# EAGLE design eu-gate (EAGLE 6.1)
AUTHOR: Vlastimil Slintak; REV: RevA
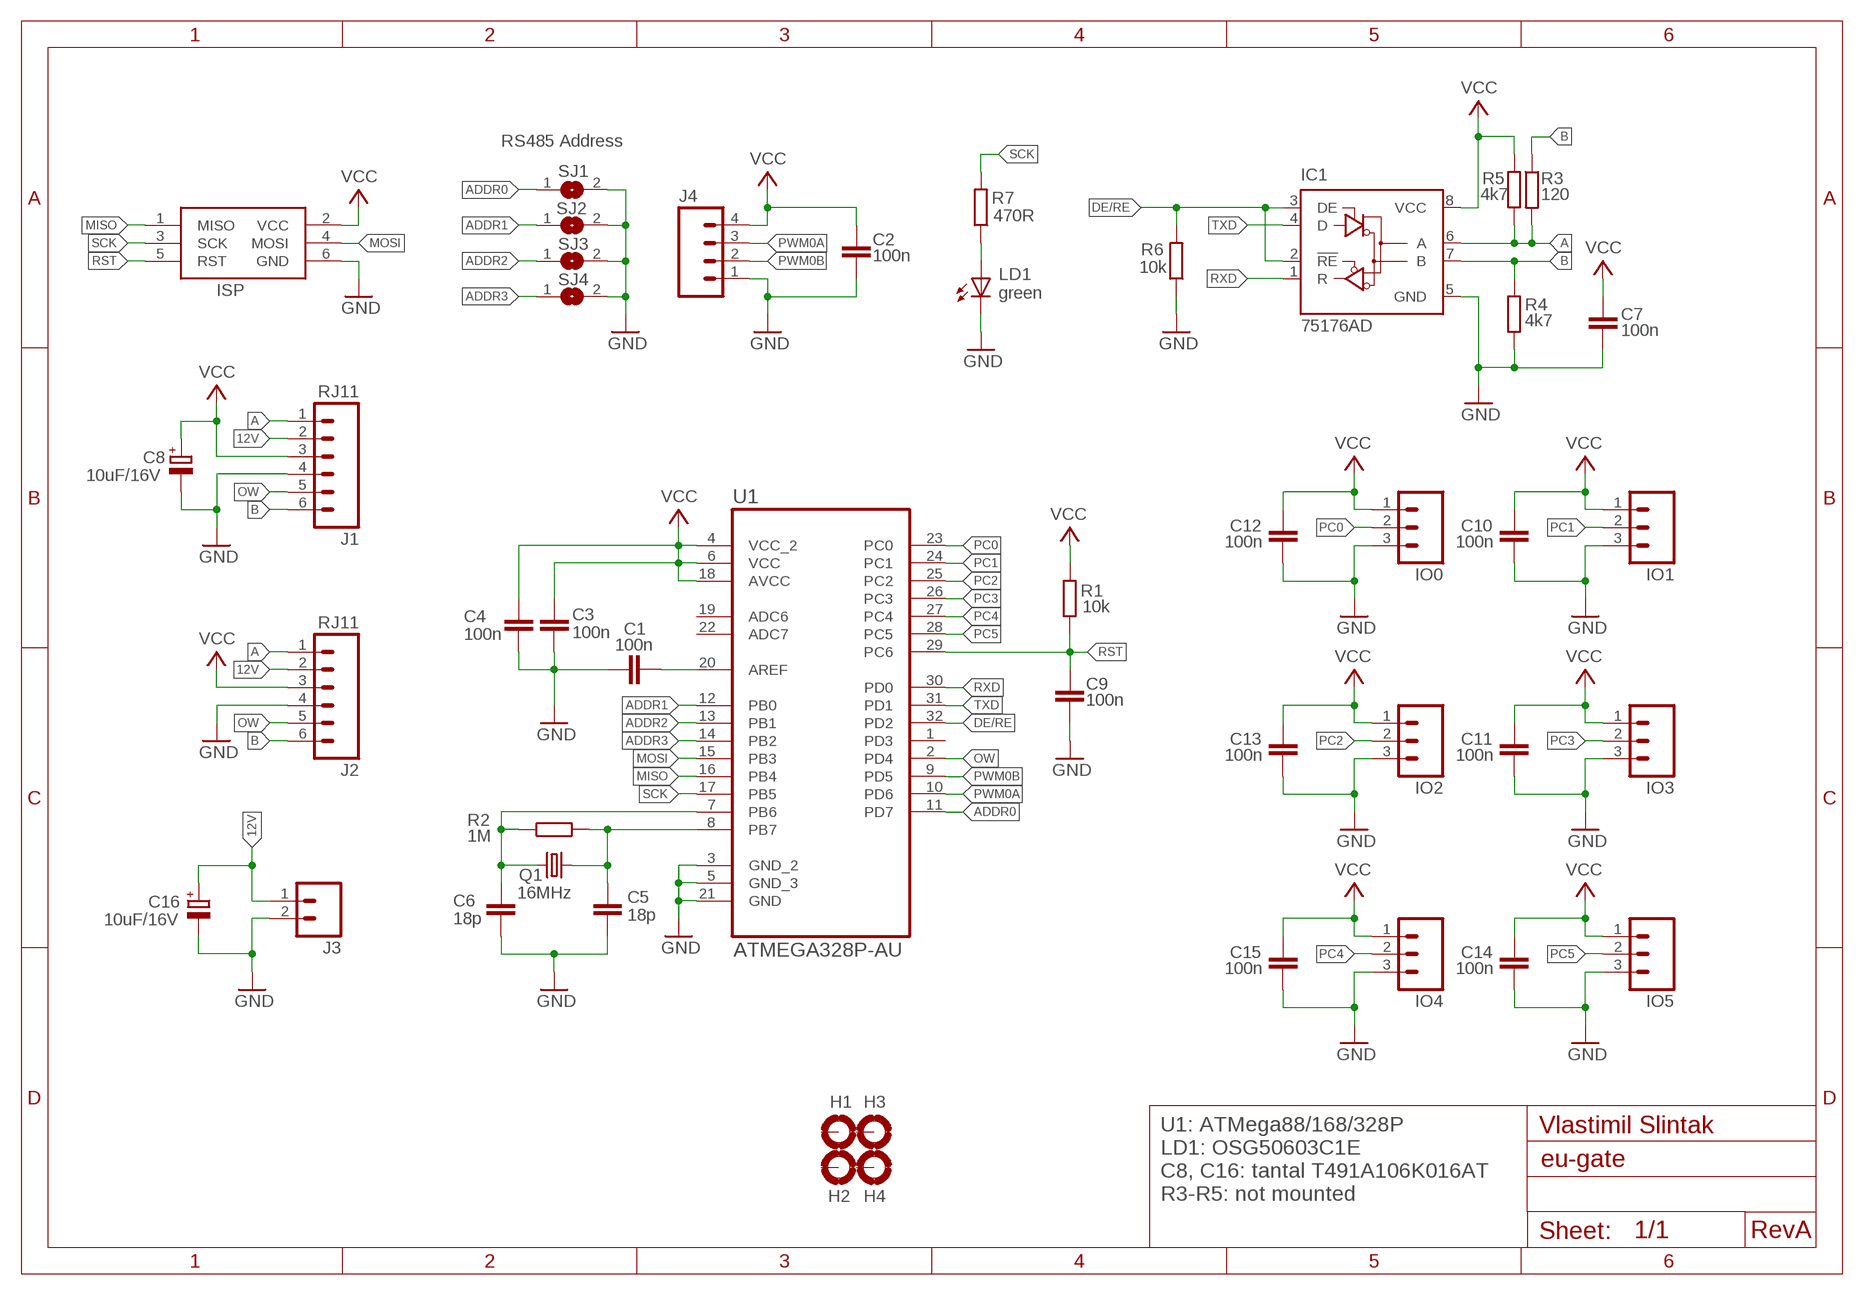
[diagram p0: schematic, sheet 1]

## Parts
C1  100n  C-EUC0603  [C0603]
C2  100n  C-EUC0603  [C0603]
C3  100n  C-EUC0603  [C0603]
C4  100n  C-EUC0603  [C0603]
C5  18p  C-EUC0603  [C0603]
C6  18p  C-EUC0603  [C0603]
C7  100n  C-EUC0603  [C0603]
C8  10uF/16V  CPOL-EUSMCA  [SMC_A]
C9  100n  C-EUC0603  [C0603]
C10  100n  C-EUC0603  [C0603]
C11  100n  C-EUC0603  [C0603]
C12  100n  C-EUC0603  [C0603]
C13  100n  C-EUC0603  [C0603]
C14  100n  C-EUC0603  [C0603]
C15  100n  C-EUC0603  [C0603]
C16  10uF/16V  CPOL-EUSMCA  [SMC_A]
H1  MOUNT-PAD-ROUND3.0  [3,0-PAD]
H2  MOUNT-PAD-ROUND3.0  [3,0-PAD]
H3  MOUNT-PAD-ROUND3.0  [3,0-PAD]
H4  MOUNT-PAD-ROUND3.0  [3,0-PAD]
IC1  75176AD  [D_R-PDSO-G8]
IO0  M03POLAR  [MOLEX-1X3]
IO1  M03POLAR  [MOLEX-1X3]
IO2  M03POLAR  [MOLEX-1X3]
IO3  M03POLAR  [MOLEX-1X3]
IO4  M03POLAR  [MOLEX-1X3]
IO5  M03POLAR  [MOLEX-1X3]
ISP  AVRISP-6  [AVRISP]
J1  RJ11  RJ11-6PTH  [RJ11-6]
J2  RJ11  RJ11-6PTH  [RJ11-6]
J3  M02POLAR  [MOLEX-1X2]
J4  M04POLAR  [MOLEX-1X4]
LD1  green  LEDCHIPLED_0603  [CHIPLED_0603]
Q1  16MHz  CRYSTALHC49UP  [HC49UP]
R1  10k  R-EU_R0603  [R0603]
R2  1M  R-EU_R0603  [R0603]
R3  120  R-EU_R0603  [R0603]
R4  4k7  R-EU_R0603  [R0603]
R5  4k7  R-EU_R0603  [R0603]
R6  10k  R-EU_R0603  [R0603]
R7  470R  R-EU_R0603  [R0603]
SJ1  SJ  [SJ]
SJ2  SJ  [SJ]
SJ3  SJ  [SJ]
SJ4  SJ  [SJ]
U1  ATMEGA328P-AU  [32TQFP]

## Nets
12V: C16.+ J1.2 J2.2 J3.1
A: IC1.6(A) J1.1 J2.1 R3.2 R5.1
ADDR0: SJ1.1 U1.11(PD7)
ADDR1: SJ2.1 U1.12(PB0)
ADDR2: SJ3.1 U1.13(PB1)
ADDR3: SJ4.1 U1.14(PB2)
B: IC1.7(B) J1.6 J2.6 R3.1 R4.2
DE/RE: IC1.2(!RE) IC1.3(DE) R6.2 U1.32(PD2)
GND: C1.1 C2.1 C3.1 C4.1 C5.2 C6.2 C7.2 C8.- C9.1 C10.1 C11.1 C12.1 C13.1 C14.1 C15.1 C16.- IC1.5(GND) IO0.3 IO1.3 IO2.3 IO3.3 IO4.3 IO5.3 ISP.6(GND) J1.4 J2.4 J3.2 J4.1 LD1.C R4.1 R6.1 SJ1.2 SJ2.2 SJ3.2 SJ4.2 U1.3(GND_2) U1.5(GND_3) U1.21(GND)
MISO: ISP.1(MISO) U1.16(PB4)
MOSI: ISP.4(MOSI) U1.15(PB3)
N$2: C1.2 U1.20(AREF)
N$3: LD1.A R7.1
N$5: C5.1 Q1.1 R2.2 U1.8(PB7)
OW: J1.5 J2.5 U1.2(PD4)
PC0: IO0.2 U1.23(PC0)
PC1: IO1.2 U1.24(PC1)
PC2: IO2.2 U1.25(PC2)
PC3: IO3.2 U1.26(PC3)
PC4: IO4.2 U1.27(PC4)
PC5: IO5.2 U1.28(PC5)
PWM0A: J4.3 U1.10(PD6)
PWM0B: J4.2 U1.9(PD5)
RST: C9.2 ISP.5(RST) R1.1 U1.29(PC6)
RXD: IC1.1(R) U1.30(PD0)
SCK: ISP.3(SCK) R7.2 U1.17(PB5)
TXD: IC1.4(D) U1.31(PD1)
VCC: C2.2 C3.2 C4.2 C7.1 C8.+ C10.2 C11.2 C12.2 C13.2 C14.2 C15.2 IC1.8(VCC) IO0.1 IO1.1 IO2.1 IO3.1 IO4.1 IO5.1 ISP.2(VCC) J1.3 J2.3 J4.4 R1.2 R5.2 U1.4(VCC_2) U1.6(VCC) U1.18(AVCC)
XYZ: C6.1 Q1.2 R2.1 U1.7(PB6)
Unconnected: H1.B3,0(MOUNT) H2.B3,0(MOUNT) H3.B3,0(MOUNT) H4.B3,0(MOUNT) U1.1(PD3) U1.19(ADC6) U1.22(ADC7)

## Notes on the sheet
- RS485 Address
- U1: ATMega88/168/328P
- LD1: OSG50603C1E
- C8, C16: tantal T491A106K016AT
- R3-R5: not mounted

## Library data of the parts
C1-C7 C9-C15 = rcl:C-EU: CAPACITOR, European symbol
C8 C16 = rcl:CPOL-EU: POLARIZED CAPACITOR, European symbol
H1-H4 = holes:MOUNT-PAD-ROUND: MOUNTING PAD, round
IC1 = 751xx:75176A: DIFFERENTIAL BUS TRANSCEIVER Source: http://focus.ti.com/lit/ds/symlink/sn75176a.pdf
IO0 IO1-IO5 = SparkFun-Connectors:M03: Header 3 Standard 3-pin 0.1" header. Use with straight break away headers (SKU : PRT-00116), right angle break away headers (PRT-00553), swiss pins (PRT-00743), machine pins (PRT-00117), and female headers (PRT-00115). Molex polarized connector foot print use with SKU : PRT-08232 with associated crimp pins and housings.
ISP = adafruit:AVRISP: AVR ISP HEADER Standard 6 pin header for AVR programming
J1 J2 = SparkFun-Connectors:RJ11-6: RJ11 Jack Simple 6 pin RJ11 jack. Commonly found on CAT3 devices and Microchip programmers. SKU: PRT-00132; PROD_ID: CONN-08590
J3 = SparkFun-Connectors:M02: Standard 2-pin 0.1" header. Use with - straight break away headers ( PRT-00116) - right angle break away headers (PRT-00553) - swiss pins (PRT-00743) - machine pins (PRT-00117) - female headers (PRT-00115) Molex polarized connector foot print use with: PRT-08233 with associated crimp pins and housings. 2.54_SCREWTERM for use with PRT-10571. 3.5mm Screw Terminal footprints for PRT-08084 5mm Screw Terminal footprints for use with PRT-08432
J4 = SparkFun-Connectors:M04: Header 4 Standard 4-pin 0.1" header. Use with straight break away headers (SKU : PRT-00116), right angle break away headers (PRT-00553), swiss pins (PRT-00743), machine pins (PRT-00117), and female headers (PRT-00115). Molex polarized connector foot print use with SKU : PRT-08231 with associated crimp pins and housings. 1MM SMD Version SKU: PRT-10208
LD1 = adafruit:LED: LED OSRAM: - CHIPLED LG R971, LG N971, LY N971, LG Q971, LY Q971, LO R971, LY R971 LH N974, LH R974 LS Q976, LO Q976, LY Q976 LO Q996 - Hyper CHIPLED LW Q18S LB Q993, LB Q99A, LB R99A - SideLED LS A670, LO A670, LY A670, LG A670, LP A670 LB A673, LV A673, LT A673, LW A673 LH A674 LY A675 LS A676, LA A676, LO A676, LY A676, LW A676 LS A679, LY A679, LG A679 - Hyper Micro SIDELED® LS Y876, LA Y876, LO Y876, LY Y876 LT Y87S - SmartLED LW L88C, LW L88S LB L89C, LB L89S, LG L890 LS L89K, LO L89K, LY L89K LS L896, LA L896, LO L896, LY L896 - TOPLED LS T670, LO T670, LY T670, LG T670, LP T670 LSG T670, LSP T670, LSY T670, LOP T670, LYG T670 LG T671, LOG T671, LSG T671 LB T673, LV T673, LT T673, LW T673 LH T674 LS T676, LA T676, LO T676, LY T676, LB T676, LH T676, LSB T676, LW T676 LB T67C, LV T67C, LT T67C, LS T67K, LO T67K, LY T67K, LW E67C LS E67B, LA E67B, LO E67B, LY E67B, LB E67C, LV E67C, LT E67C LW T67C LS T679, LY T679, LG T679 LS T770, LO T770, LY T770, LG T770, LP T770 LB T773, LV T773, LT T773, LW T773 LH T774 LS E675, LA E675, LY E675, LS T675 LS T776, LA T776, LO T776, LY T776, LB T776 LHGB T686 LT T68C, LB T68C - Hyper Mini TOPLED® LB M676 - Mini TOPLED Santana® LG M470 LS M47K, LO M47K, LY M47K Source: http://www.osram.convergy.de/
Q1 = crystal:CRYSTAL: CRYSTAL; OC_FARNELL: unknown; OC_NEWARK: unknown
R1-R7 = rcl:R-EU_: RESISTOR, European symbol
SJ1-SJ4 = jumper:SJ: SMD solder JUMPER
U1 = uArt:ATMEGA328P; DESCRIPTION: 8-bit Microcontroller with In-System Programmable Flash; OC_FARNELL: 1715486; OC_GME: 958-170

## Board
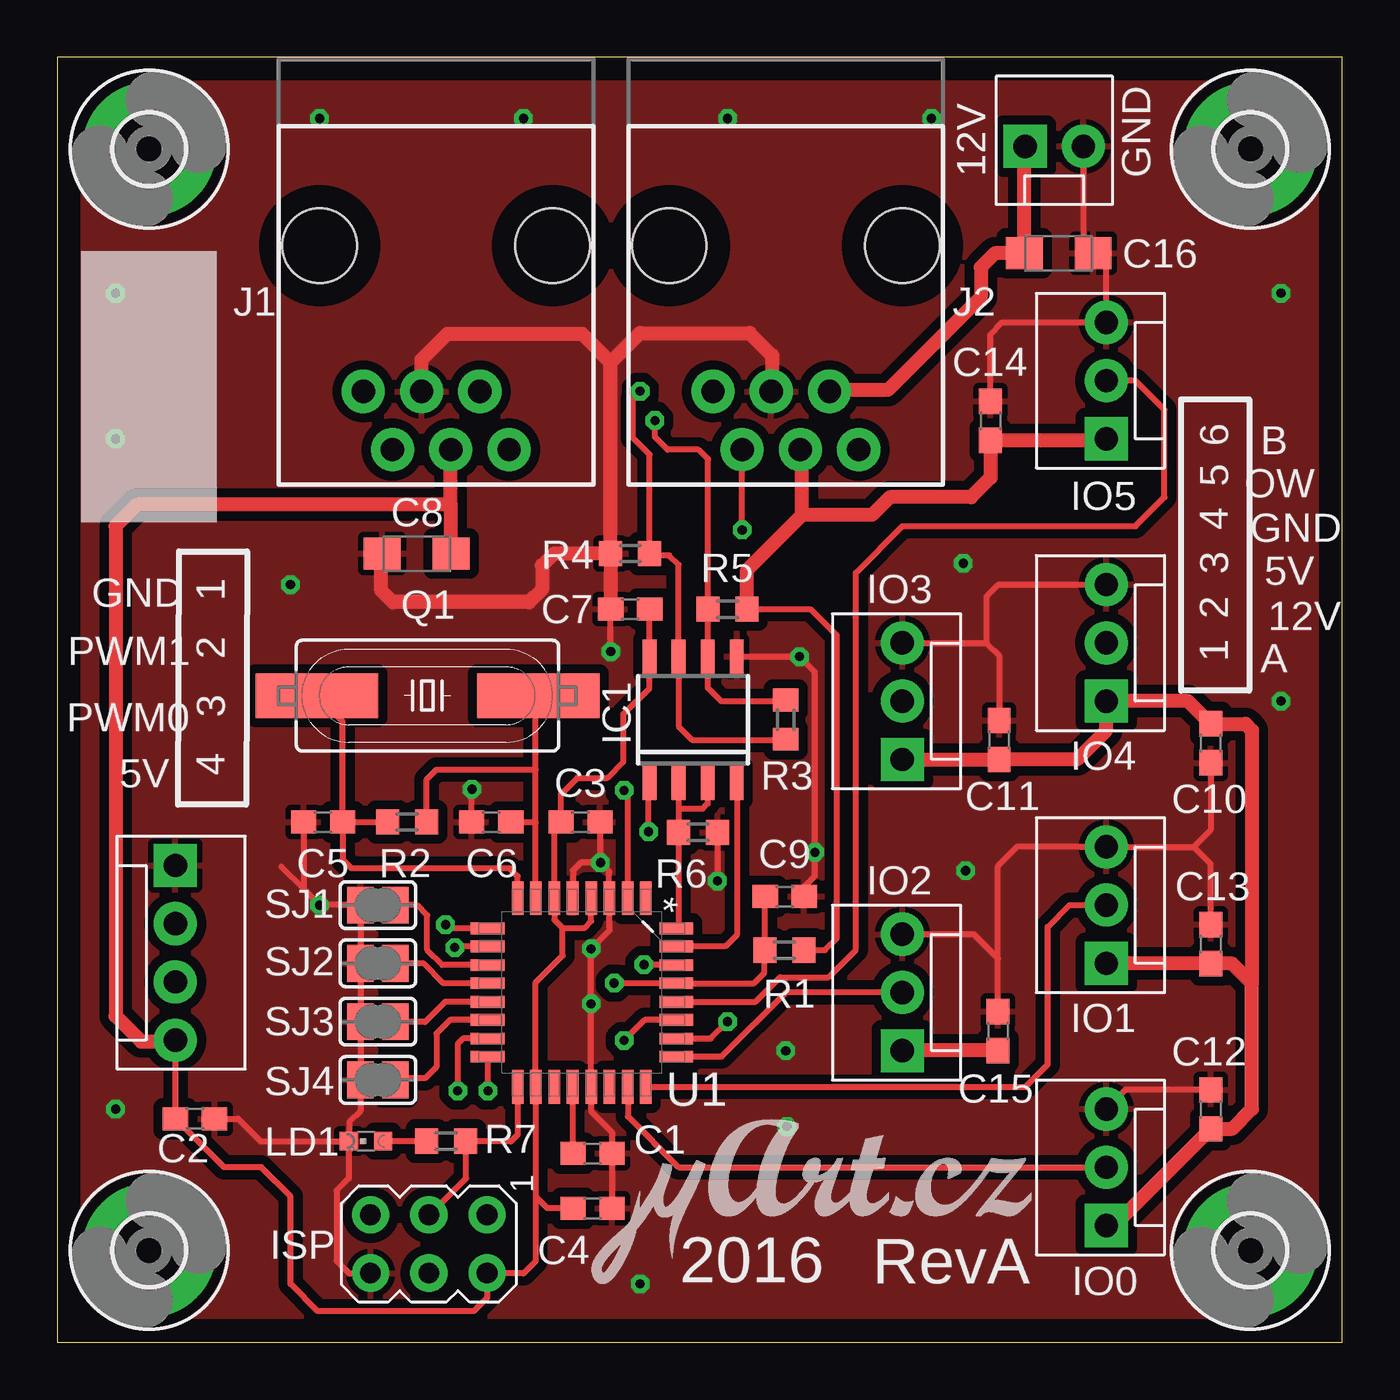
[diagram p1: board, top side]
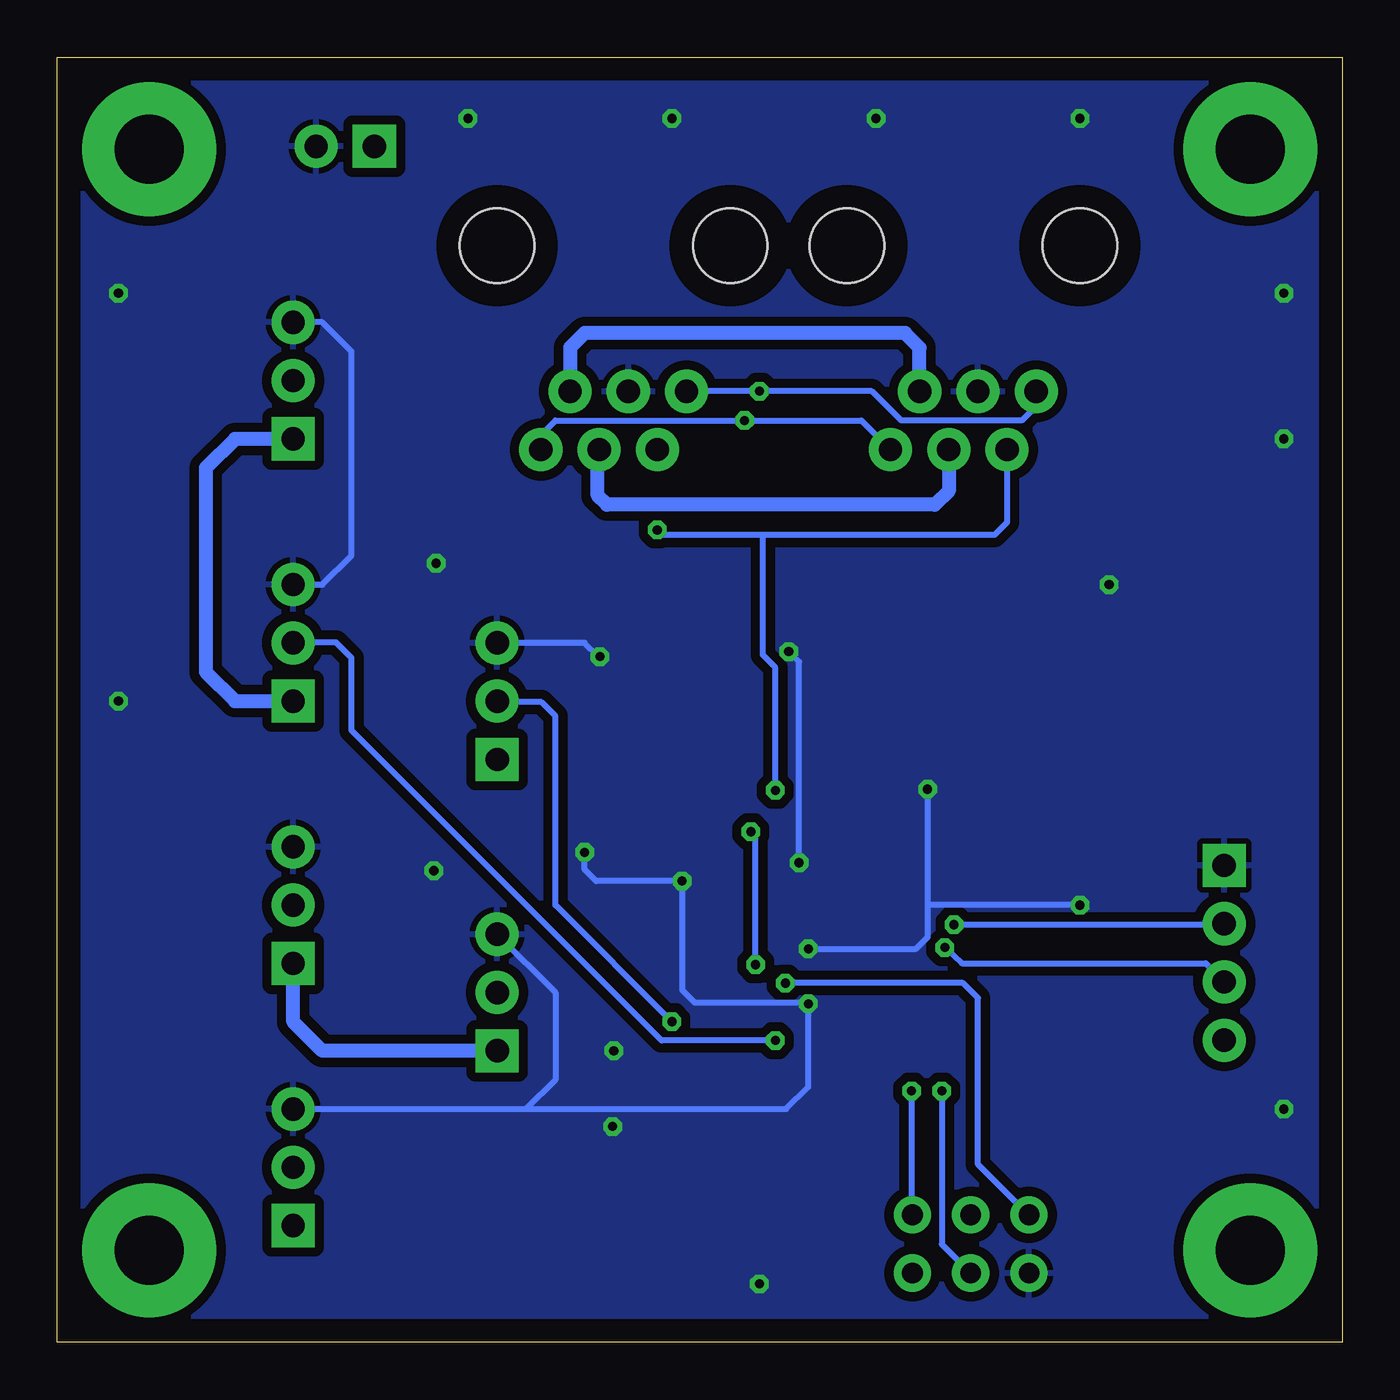
[diagram p2: board, bottom side, seen from below]

Size 56 x 56 mm. Coordinates in mm from the lower left corner, seen from the top.
Outline: 0,56 0,0 56,0 56,56 0,56
Copper layers (1*16): Top 0.035mm / dielectric 1.5mm / Bottom 0.035mm
Design rules: minimum track width 10mil, minimum drill 0.4mm, track to track 8mil, track to pad 8mil, pad to pad 8mil, via to via 8mil, smd to smd 8mil, copper to edge 40mil, drill to drill 8mil, minimum pad ring 10mil, minimum via ring 8mil, stop-mask expansion 4mil, vias tented up to drill 0mil, thermal gap 10mil

### Footprints (pad centres in the part's own frame; a part is rotated, then mirrored left to right if it is on the bottom)
C0603 = smd 1.1 x 1: 1 -0.85,0; 2 0.85,0
SMC_A = smd 1.6 x 1.4: + -1.5,0; - 1.5,0
3,0-PAD = drill 3 pad 5.842: B3,0 0,0
D_R-PDSO-G8 = smd 0.6 x 1.5: 1 -1.905,-2.75; 2 -0.635,-2.75; 3 0.635,-2.75; 4 1.905,-2.75; 5 1.905,2.75; 6 0.635,2.75; 7 -0.635,2.75; 8 -1.905,2.75
MOLEX-1X3 = drill 1.016 pad 1.88 square: 1 0,0 | drill 1.016 pad 1.88: 2 2.54,0; 3 5.08,0
AVRISP = drill 0.9 pad 1.626: 1 -1.27,2.54; 2 1.27,2.54; 3 -1.27,0; 4 1.27,0; 5 -1.27,-2.54; 6 1.27,-2.54
RJ11-6 = drill 1.016 pad 1.88: 1 -3.175,8.89; 2 -1.905,6.35; 3 -0.635,8.89; 4 0.635,6.35; 5 1.905,8.89; 6 3.175,6.35 | hole 3.251: -5.08,0; 5.08,0
MOLEX-1X2 = drill 1.016 pad 1.88 square: 1 0,0 | drill 1.016 pad 1.88: 2 2.54,0
MOLEX-1X4 = drill 1.016 pad 1.88 square: 1 0,0 | drill 1.016 pad 1.88: 2 2.54,0; 3 5.08,0; 4 7.62,0
CHIPLED_0603 = smd 0.8 x 0.8: A 0,-0.75; C 0,0.75
HC49UP = smd 5.334 x 1.93: 1 -4.826,0; 2 4.826,0
R0603 = smd 1 x 1.1: 1 -0.85,0; 2 0.85,0
SJ = smd 1.168 x 1.6: 1 -0.762,0; 2 0.762,0
32TQFP = smd 1.473 x 0.508: 1 -4.115,2.794; 2 -4.115,2.007; 3 -4.115,1.194; 4 -4.115,0.406; 5 -4.115,-0.406; 6 -4.115,-1.194; 7 -4.115,-2.007; 8 -4.115,-2.794; 17 4.115,-2.794; 18 4.115,-2.007; 19 4.115,-1.194; 20 4.115,-0.406; 21 4.115,0.406; 22 4.115,1.194; 23 4.115,2.007; 24 4.115,2.794 | smd 0.508 x 1.473: 9 -2.794,-4.115; 10 -2.007,-4.115; 11 -1.194,-4.115; 12 -0.406,-4.115; 13 0.406,-4.115; 14 1.194,-4.115; 15 2.007,-4.115; 16 2.794,-4.115; 25 2.794,4.115; 26 2.007,4.115; 27 1.194,4.115; 28 0.406,4.115; 29 -0.406,4.115; 30 -1.194,4.115; 31 -2.007,4.115; 32 -2.794,4.115

### Placement (x,y rotation side)
C1  23.33,8.22 180 top
C2  6,9.74 180 top
C3  22.8,22.67 180 top
C4  23.33,5.84 180 top
C5  11.58,22.67 180 top
C6  18.91,22.67 180 top
C7  24.97,31.95 180 top
C8  15.66,34.37 180 top
C9  31.7,19.42 180 top
C10  50.27,26.1 90 top
C11  41.05,26.25 270 top
C12  50.27,10.15 270 top
C13  50.27,17.35 270 top
C14  40.67,40.16 270 top
C15  41,13.56 270 top
C16  43.65,47.46 0 top
H1  52,52 0 top
H2  52,4 0 top
H3  4,52 0 top
H4  4,4 0 top
IC1  27.71,27.13 0 top
IO0  45.72,5.08 90 top
IO1  45.72,16.51 90 top
IO2  36.83,12.7 90 top
IO3  36.83,25.4 90 top
IO4  45.72,27.94 90 top
IO5  45.72,39.37 90 top
ISP  16.19,4.28 270 top
J1  16.51,47.79 180 top
J2  31.75,47.79 180 top
J3  42.18,52.12 0 top
J4  5.14,20.78 270 top
LD1  13.45,8.76 90 top
Q1  16.13,28.18 0 top
R1  31.69,17.09 0 top
R2  15.25,22.67 180 top
R3  31.75,27.13 90 top
R4  24.97,34.37 0 top
R5  29.21,31.95 0 top
R6  27.92,22.22 180 top
R7  16.94,8.76 0 top
SJ1  13.97,19.05 180 top
SJ2  13.97,16.51 180 top
SJ3  13.97,13.97 180 top
SJ4  13.97,11.43 180 top
U1  22.86,15.24 270 top
U$1  [UART-LOGO]  23.28,2.54 0 top

### Tracks (layer width: path | path; a pad name or v marks a point on that pad's centre or on a via)
12V
  Top 0.61: J3.1 42.15,52.09 C16.+ 40.86,47.46 40.25,46.85 40.25,45.55 36.2,41.5 33.72,41.5 J2.2
  Bottom 0.61: J1.2 18.41,43.34 19.05,43.98 33.02,43.98 33.65,43.35 J2.2
A  (via drill 0.4)
  Top 0.254: R3.2 31.72,27.95 28.92,27.95 28.34,28.52 IC1.6 28.36,29.89 R5.1 28.36,38.48 27.94,38.9 26.6,38.9 26.05,39.45 v26.05,40.17
  Bottom 0.254: J2.1 34.92,39.53 34.29,40.17 v26.05,40.17 20.95,40.17 J1.1
ADDR0
  Top 0.254: U1.11 16.79,16.43 16.12,17.1 16.12,18.6 15.67,19.05 SJ1.1
ADDR1
  Top 0.254: U1.12 16.82,15.65 15.97,16.5 14.74,16.5 SJ2.1
ADDR2
  Top 0.254: U1.13 16.9,14.83 16.02,13.95 14.75,13.95 SJ3.1
ADDR3
  Top 0.254: U1.14 17.12,14.05 16.52,13.45 16.52,12 16.02,11.5 14.8,11.5 SJ4.1
B  (via drill 0.4)
  Top 0.254: R3.1 31.72,26.25 27.67,26.25 27.07,26.84 IC1.7 27.07,33.88 26.67,34.29 25.9,34.29 R4.2 25.82,38.68 25.1,39.4 25.1,41.15 v25.4,41.45
  Bottom 0.254: J2.6 v25.4,41.45 20.5,41.45 19.22,40.17 13.97,40.17 13.34,40.8 J1.6
DE/RE
  Top 0.254: IC1.2 27.07,23.3 | 27.07,23.3 R6.2 27.07,18.13 U1.32 | IC1.3 28.34,23.48 28.12,23.25 27.12,23.25 27.07,23.3
GND  (via drill 0.4)
  Top 0.254: 22.47,19.34 U1.5 22.47,19.37 22.47,20.55 22.82,20.9 v23.67,20.9 | 24.07,19.37 U1.3 | U1.3 24.07,19.34 24.07,17.95 v23.27,17.15 v23.27,14.75 U1.21 23.27,10.05 24.17,9.15 C1.1 C4.1 | 23.72,22.6 C3.1 23.67,22.65 v23.67,20.9 | LD1.C 12.72,8.78 12.72,9.6 13.21,10.09 SJ4.2 SJ3.2 SJ2.2 SJ1.2 v11.43,19.05 10.73,19.75 | LD1.C 12.7,7.13 12.17,6.6 12.17,3.55 12.72,3 ISP.6 | C5.2 10.73,19.75 | R6.1 v28.77,20.1 | IC1.5 v32.35,29.88 33.02,29.21 v33.02,21.35 33.02,20.32 32.55,19.85 C9.1 | C6.2 18.06,23.94 v18.07,24.1 | U1.3 24.05,20.52 v23.67,20.9 | v24.12,30.1 C7.2 | C2.1 7.88,9.74 8.87,8.75 LD1.C | 9.76,20.72 10.73,19.75 | C12.1 46.56,11 IO0.3 | C13.1 50.27,20.85 49.53,21.59 | C10.1 50.27,22.33 49.53,21.59 | C14.1 40.65,41.03 40.65,43.9 41.2,44.45 IO5.3 45.72,46.89 C16.- 44.72,47.89 J3.2 | C15.1 41,16.72 | 41,16.72 39.94,17.78 IO2.3 | 41,16.72 41,20.75 41.85,21.6 42.56,21.59 IO1.3 49.53,21.59 | IO3.3 40.47,30.48 40.5,30.45 | 40.5,30.45 41.05,29.9 C11.1 | 40.5,30.45 40.5,32.5 41.02,33.02 IO4.3
  Top 0.61: R4.1 C7.2 | R4.1 21.64,34.37 21.12,33.85 21.12,32.8 20.57,32.25 14.62,32.25 14.12,32.75 14.12,34.33 | R4.1 24.12,42.7 | 24.12,42.7 25.4,43.98 30.17,43.98 31.15,43 31.15,41.48 J2.4 | J1.4 15.88,42.83 17,43.95 22.87,43.95 24.12,42.7
  Bottom 0.254: v33.02,21.35 33.02,20.6 32.52,20.1 v28.77,20.1 28.77,15.35 28.22,14.8 23.32,14.8 v23.27,14.75 U1.21 24.23,10.16 35.56,10.16 | v18.07,24.1 18.07,19.05 | 18.07,19.05 18.07,17.65 18.57,17.15 v23.27,17.15 | v11.43,19.05 18.07,19.05 | v23.67,20.9 23.67,29.65 v24.12,30.1 | v32.35,29.88 32.42,29.88 33.02,30.48 IO3.3 | IO4.3 44.45,33.02 43.18,34.29 43.18,43.18 44.45,44.45 IO5.3 | IO0.3 35.56,10.16 | IO2.3 34.29,15.24 34.29,11.43 35.56,10.16
  other vias: 31.75,12.7 11.43,53.34 20.32,53.34 29.21,53.34 38.1,53.34 2.54,45.72 2.54,39.37 2.54,10.16 10.16,33.02 53.34,45.72 53.34,27.94 39.59,20.55 25.4,2.54 31.8,9.4 39.49,33.95
  pour Top (isolate 0.406): 0,0 55.88,0 55.88,55.88 0,55.88
  pour Bottom (isolate 0.406): 0,0 55.88,0 55.88,55.88 0,55.88
MISO  (via drill 0.4)
  Top 0.254: U1.16 18.75,10.97 v18.77,10.95
  Bottom 0.254: v18.77,10.95 18.77,5.59 ISP.1
MOSI  (via drill 0.4)
  Top 0.254: U1.15 17.68,13.23 17.45,13 v17.45,10.95
  Bottom 0.254: v17.45,10.95 17.45,4.27 ISP.4
N$2
  Top 0.254: U1.20 22.45,8.25 C1.2
N$3
  Top 0.254: R7.1 LD1.A
N$5
  Top 0.254: U1.8 20.07,20.3 19.72,20.65 12.82,20.65 12.43,21.04 C5.1 | C5.1 12.43,27.05 Q1.1 | C5.1 R2.2
OW  (via drill 0.4)
  Top 0.254: U1.2 24.87,23.88 v24.7,24.05 | v29.85,35.4 J2.5
  Bottom 0.254: v24.7,24.05 24.7,29.4 25.25,29.95 25.25,35.18 | J1.5 14.61,35.73 15.15,35.18 25.25,35.18 | 25.25,35.18 29.63,35.18 v29.85,35.4
PC0
  Top 0.254: U1.23 24.87,9.83 27.08,7.62 IO0.2
PC1
  Top 0.254: U1.24 42.2,11.12 43.17,12.1 43.17,18.1 44.12,19.05 IO1.2
PC2
  Top 0.254: U1.25 28.96,12.45 31.75,15.24 IO2.2
PC3  (via drill 0.4)
  Top 0.254: U1.26 28.47,13.23 v29.21,13.97
  Bottom 0.254: v29.21,13.97 34.29,19.05 34.29,27.29 34.9,27.9 36.79,27.9 IO3.2
PC4  (via drill 0.4)
  Top 0.254: U1.27 25.6,14.05 v24.7,13.15
  Bottom 0.254: v24.7,13.15 29.66,13.15 43.18,26.67 43.18,29.83 43.85,30.5 45.7,30.5 IO4.2
PC5
  Top 0.254: U1.28 30.43,14.83 31.5,15.9 33.6,15.9 34.8,17.1 34.8,33.53 36.83,35.56 46.99,35.56 48.26,36.83 48.26,40.64 46.99,41.91 IO5.2
PWM0A  (via drill 0.4)
  Top 0.254: U1.10 17.37,17.25 v17.32,17.2
  Bottom 0.254: v17.32,17.2 16.58,16.51 5.95,16.51 J4.3
PWM0B  (via drill 0.4)
  Top 0.254: U1.9 17.09,18.03 v16.92,18.2
  Bottom 0.254: v16.92,18.2 5.18,18.2 J4.2
RST  (via drill 0.4)
  Top 0.254: v24.27,15.65 U1.29 30.37,15.65 30.82,16.1 30.82,17.07 R1.1 C9.2
  Bottom 0.254: ISP.5 13.67,5.55 15.87,7.75 15.87,15 16.52,15.65 v24.27,15.65
RXD  (via drill 0.4)
  Top 0.254: U1.30 25.59,16.43 v25.57,16.45 | v25.77,22.25 25.77,24.34 IC1.1
  Bottom 0.254: v25.57,16.45 25.57,22.05 v25.77,22.25
SCK
  Top 0.254: ISP.3 16.22,5.55 17.82,7.15 17.82,8.73 R7.2 19.77,8.75 20.07,9.05 U1.17
TXD
  Top 0.254: IC1.4 29.61,17.75 29.12,17.25 U1.31
VCC
  Top 0.254: 22.02,18.05 21.67,18.4 U1.6 21.67,22.39 C3.2 21.95,23.88 22.67,24.6 23.97,24.6 24.67,25.3 24.67,27.37 25.8,28.5 IC1.8 25.82,29.89 C7.1 | 22.02,18.05 22.97,18.05 23.27,18.35 U1.4 | 22.02,18.05 22.02,16.85 20.85,15.68 U1.18 20.85,6.35 | 20.85,6.35 20.85,3.53 20.32,3 ISP.2 | ISP.2 | R1.2 33.46,17.09 33.97,17.6 33.97,30.8 32.82,31.95 R5.2 | C4.2 21.36,5.84 20.85,6.35 | ISP.2 18.74,1.94 18.15,1.35 11.35,1.35 10.16,2.54 10.16,6.35 8.89,7.62 7.27,7.62 C2.2 J4.4
  Top 0.61: R5.2 30.06,33.66 32.45,36.05 | 32.45,36.05 32.45,38.84 J2.3 | 17.15,36.5 3.48,36.5 2.54,35.56 2.54,14.21 3.65,13.1 5.08,13.1 J4.4 | 17.15,36.5 C8.+ | 32.45,36.05 35.5,36.05 36.28,36.83 39.82,36.83 40.67,37.68 C14.2 45.66,39.31 IO5.1 | 52.07,15.63 52.07,10.16 51.21,9.3 C12.2 46.05,5.08 IO0.1 | 52.07,15.63 51.2,16.5 C13.2 IO1.1 | 52.07,15.63 52.07,26.67 51.79,26.95 C10.2 49.28,27.94 IO4.1 45.72,26.67 44.45,25.4 C11.2 IO3.1 | 17.15,36.5 J1.3 | C15.2 IO2.1
  Bottom 0.61: J1.3 17.14,37.1 17.75,36.5 32.05,36.5 32.45,36.9 32.45,38.84 J2.3 | IO5.1 48.26,39.37 49.53,38.1 49.53,29.21 48.26,27.94 IO4.1 | IO2.1 44.45,12.7 45.72,13.97 IO1.1
XYZ
  Top 0.254: U1.7 20.85,22.65 | 20.85,22.65 20.85,24.95 | 20.85,24.95 20.85,28.08 Q1.2 | C6.1 20.83,22.67 20.85,22.65 | R2.1 16.1,24.53 16.52,24.95 20.85,24.95

### Text on the board
tNames: 12V | GND | B | 6 | OW | 5 | IO5 | GND | 4 | 5V | 3 | GND | 1 | IO3 | 2 | 12V | PWM1 | 2 | 1 | A | PWM0 | 3 | 4 | IO4 | 5V | IO2 | IO1 | IO0